# Altium schematic sheet POWER.SchDoc
size B
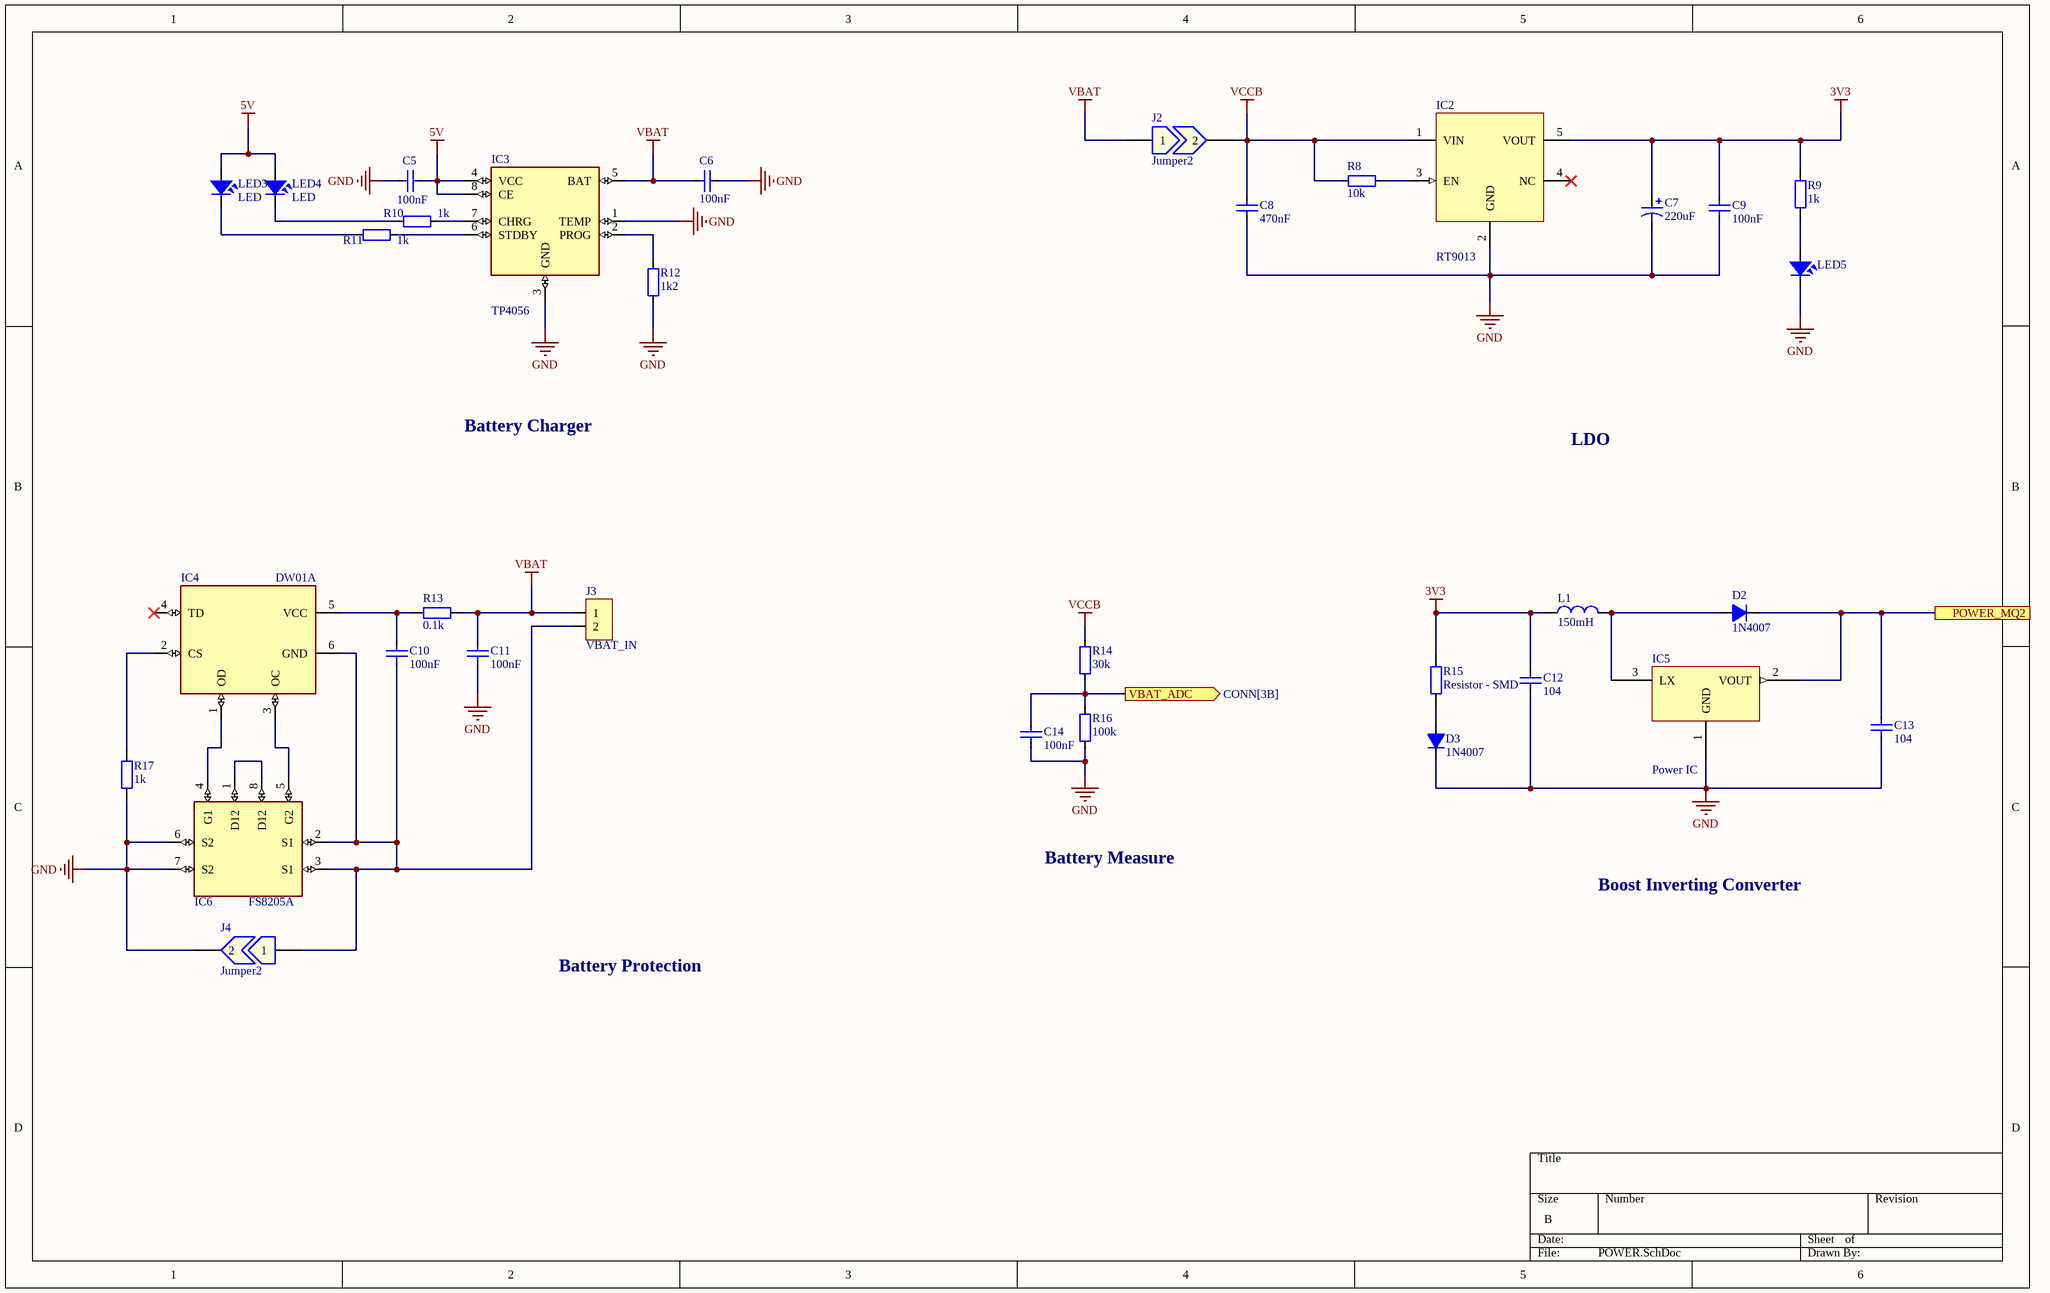
[diagram p0: POWER.SchDoc]

## Parts
C5  100nF  [CAP_0805]
C6  100nF  [CAP_0805]
C7  220uF  [CAP_TANTALUM_3216]
C8  470nF  [CAP_0805]
C9  100nF  [CAP_0805]
C10  100nF  [CAP_0805]
C11  100nF  [CAP_0805]
C12  104  [CAP_0805]
C13  104  [CAP_0805]
C14  100nF  [CAP_0805]
D2  1N4007  [D1A]
D3  1N4007  [D1A]
IC2  RT9013  [SOT23-5]
IC3  TP4056  [TP4056]
IC4  DW01A  [SOT23-6]
IC5  Power IC  [SOT-89-3]
IC6  FS8205A  [FS8205A]
J2  Jumper2  [JUMPER2]
J3  VBAT_IN  [JP2-D1T]
J4  Jumper2  [JUMPER2]
L1  150mH  [L/0.4]
LED3  LED  [LED-0805-Red]
LED4  LED  [LED-0805-Green]
LED5  (no value)  [LED-0805-Red]
R8  10k  [RES-SMD-0805]
R9  1k  [RES-SMD-0805]
R10  1k  [RES-SMD-0805]
R11  1k  [RES-SMD-0805]
R12  1k2  [RES-SMD-0805]
R13  0.1k  [RES-SMD-0805]
R14  30k  [RES-SMD-0805]
R15  Resistor - SMD  [RES-SMD-0805]
R16  100k  [RES-SMD-0805]
R17  1k  [RES-SMD-0805]

## Ports
POWER_MQ2, VBAT_ADC (out, see CONN[3B])

## Nets
3V3: C7.1 C9.1 C12.1 IC2.5(VOUT) L1.1 R9.2 R15.1
5V: C5.1 IC3.4(VCC) IC3.8(CE) LED3.1 LED4.1
GND: C5.2 C6.1 C7.2 C8.2 C9.2 C11.1 C12.2 C13.1 C14.1 D3.2(K) IC2.2(GND) IC3.1(TEMP) IC3.3(GND) IC5.1(GND) IC6.6(S2) IC6.7(S2) J4.2 LED5.2 R12.1 R16.2 R17.2
VBAT: C6.2 C11.2 IC3.5(BAT) J2.1 J3.1 R13.2
VCCB: C8.1 IC2.1(VIN) J2.2 R8.2 R14.1
POWER_MQ2: C13.2 D2.2(K) IC5.2(VOUT) ; port POWER_MQ2
VBAT_ADC: C14.2 R14.2 R16.1 ; port VBAT_ADC
NetC10_1: C10.1 IC4.6(GND) IC6.2(S1) IC6.3(S1) J3.2 J4.1
NetC10_2: C10.2 IC4.5(VCC) R13.1
NetD2_1: D2.1(A) IC5.3(LX) L1.2
NetD3_1: D3.1(A) R15.2
NetIC2_3: IC2.3(EN) R8.1
NetIC3_2: IC3.2(PROG) R12.2
NetIC3_6: IC3.6(STDBY) R11.1
NetIC3_7: IC3.7(CHRG) R10.1
NetIC4_1: IC4.1(OD) IC6.4(G1)
NetIC4_2: IC4.2(CS) R17.1
NetIC4_3: IC4.3(OC) IC6.5(G2)
NetIC6_1: IC6.1(D12) IC6.8(D12)
NetLED3_2: LED3.2 R11.2
NetLED4_2: LED4.2 R10.2
NetLED5_1: LED5.1 R9.1

Not connected (* = marked no-connect by the designer): IC2 4(NC)*; IC4 4(TD)*

## Notes on the sheet
- Battery Charger
- LDO
- Battery Measure
- Boost Inverting Converter
- Battery Protection

## Library data of the parts
C5 C6 C8-C14 = CapSMD: Capacitor; Value: 33p; Published: 8-Jun-2000; LatestRevisionDate: 17-Jul-2002; LatestRevisionNote: Re-released for DXP Platform.; PackageReference: RAD-0.3; Publisher: Altium Limited
C7 = Cap Pol: Polarized Capacitor (Axial); Published: 8-Jun-2000; LatestRevisionDate: 17-Jul-2002; LatestRevisionNote: Re-released for DXP Platform.; PackageReference: POLAR0.8; Publisher: Altium Limited
D2 D3 = D1A: Diode 1A; Value: 1N4007
IC2 = RT9013: https://linhkien.cxt.vn/5435-rt9013-33gb-ic-reg-linear-33v-500ma-sot23-5.html
IC3 = TP4056: Complete single cell Li-Ion battery with a constant current / constant voltage linear charger
IC4 = DW01A: One Cell Lithium-ion/Polymer Battery Protection IC
IC5 = CE8301A/BL8530: Boost 5V IC 500mA
J2 J4 = Jumper2: Jumper, 2-Pin
J3 = JP2: WR-PHD 2.54 mm Angled Socket Header; Manufacturer: W¨¹rth Elektronik eiSos GmbH; partNo: 613002143121; ComponentLink1 Description: Manufacturer; ComponentLink2 Description: Datasheet; NoPins: 02; Created Date: 29 March 2013; ComponentLink1URL: http://www.we-online.com; ComponentLink2URL: http://katalog.we-online.de/em/datasheet/6130xx143121.pdf; Created by: Karrer Zheng
L1 = L1: Inductor; Value: 150 mH
LED3-LED5 = LED: LED Single colour Green and Red; Value: LED 3 ly Single Colour
R8 R10-R12 R14 R16 = Resistor - SMD: Resistor; Manufacturer: Generic Components; Class: Passive; Published: 08/06/2000; Publisher: Altium Hobart Technology Centre
R9 R13 R15 R17 = Resistor - SMD: Resistor SMD; Manufacturer: Generic Components; Class: Passive; Published: 08/06/2000; Publisher: Altium Hobart Technology Centre